# EAGLE design lcd (EAGLE 7.7.0)
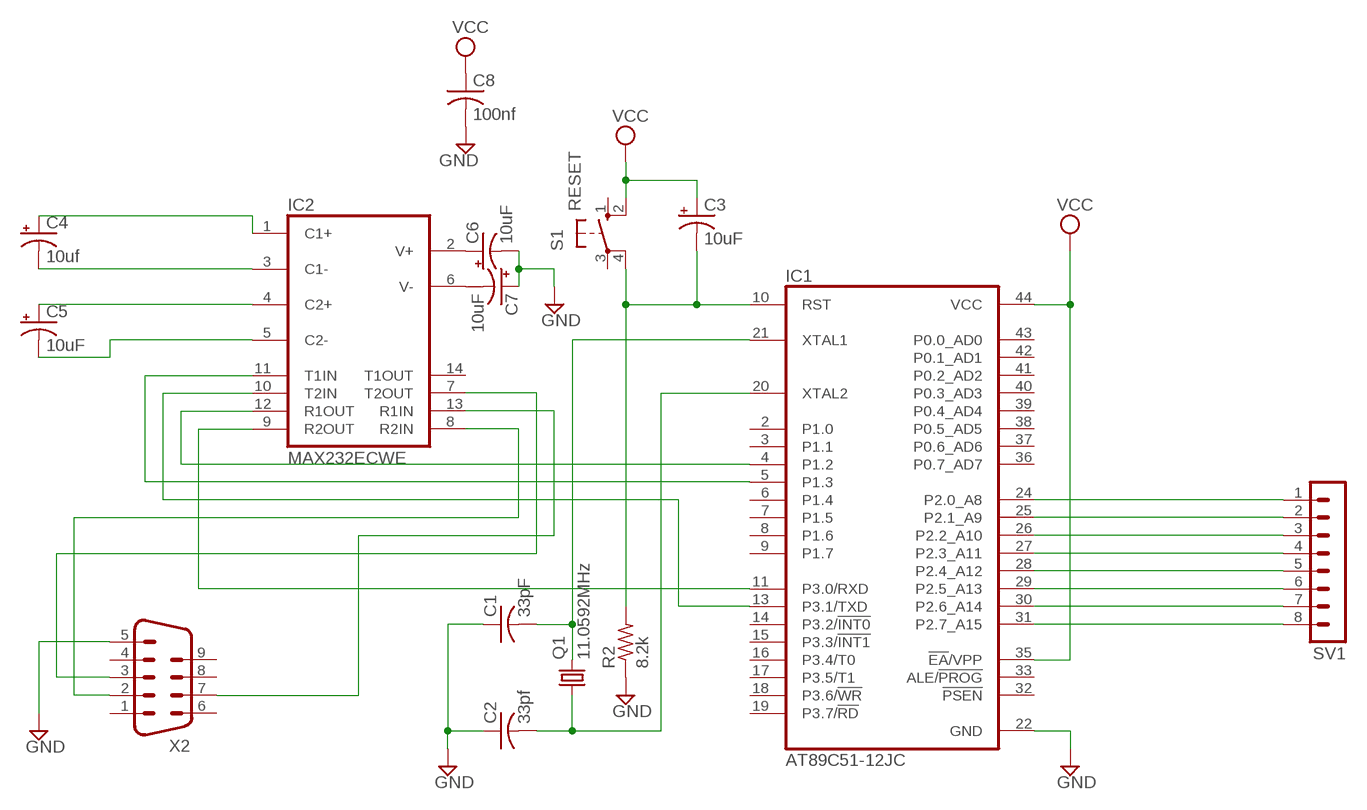
[diagram p0: schematic, sheet 1]

## Parts
C1  33pF  C-US025-025X050  [C025-025X050]
C2  33pf  C-US025-025X050  [C025-025X050]
C3  10uF  CPOL-USE2.5-5  [E2,5-5]
C4  10uf  CPOL-USE2.5-5  [E2,5-5]
C5  10uF  CPOL-USE2.5-5  [E2,5-5]
C6  10uF  CPOL-USE2.5-5  [E2,5-5]
C7  10uF  CPOL-USE2.5-5  [E2,5-5]
C8  100nf  C-US025-025X050  [C025-025X050]
IC1  AT89C51-12JC  [PLCC44]
IC2  MAX232ECWE  [SO16L]
Q1  11.0592MHz  CRYSTALTC26H  [TC26H]
R2  8.2k  R-US_R2512  [R2512]
S1  RESET  10-XX  [B3F-10XX]
SV1  MA08-1W  [MA08-1W]
X2  M09V  [M09V]

## Nets
GND: C1.1 C2.1 C6.- C7.+ C8.2 IC1.22(GND) R2.1 X2.5
N$1: IC1.24(P2.0_A8) SV1.1
N$2: IC1.25(P2.1_A9) SV1.2
N$3: IC1.26(P2.2_A10) SV1.3
N$4: IC1.27(P2.3_A11) SV1.4
N$5: IC1.28(P2.4_A12) SV1.5
N$6: IC1.29(P2.5_A13) SV1.6
N$7: IC1.30(P2.6_A14) SV1.7
N$8: IC1.31(P2.7_A15) SV1.8
N$9: IC1.5(P1.3) IC2.11(T1IN)
N$10: IC1.13(P3.1/TXD) IC2.10(T2IN)
N$11: IC1.4(P1.2) IC2.12(R1OUT)
N$12: C1.2 IC1.21(XTAL1) Q1.2
N$13: C2.2 IC1.20(XTAL2) Q1.1
N$14: IC1.11(P3.0/RXD) IC2.9(R2OUT)
N$15: C4.+ IC2.1(C1+)
N$16: C4.- IC2.3(C1-)
N$17: C3.- IC1.10(RST) R2.2 S1.4(P1)
N$18: C5.+ IC2.4(C2+)
N$19: C5.- IC2.5(C2-)
N$20: C6.+ IC2.2(V+)
N$21: C7.- IC2.6(V-)
N$22: IC2.7(T2OUT) X2.3
N$23: IC2.13(R1IN) X2.7
N$24: IC2.8(R2IN) X2.2
VCC: C3.+ C8.1 IC1.35(!EA!/VPP) IC1.44(VCC) S1.2(S1)
Unconnected: IC1.2(P1.0) IC1.3(P1.1) IC1.6(P1.4) IC1.7(P1.5) IC1.8(P1.6) IC1.9(P1.7) IC1.14(P3.2/!INT0) IC1.15(P3.3/!INT1) IC1.16(P3.4/T0) IC1.17(P3.5/T1) IC1.18(P3.6/!WR) IC1.19(P3.7/!RD) IC1.32(!PSEN) IC1.33(ALE/!PROG) IC1.36(P0.7_AD7) IC1.37(P0.6_AD6) IC1.38(P0.5_AD5) IC1.39(P0.4_AD4) IC1.40(P0.3_AD3) IC1.41(P0.2_AD2) IC1.42(P0.1_AD1) IC1.43(P0.0_AD0) IC2.14(T1OUT) S1.1(S) S1.3(P) X2.1 X2.4 X2.6 X2.8 X2.9

## Power pins joined to a net without a drawn wire
GND: IC2.15(GND)
VCC: IC2.16(VCC)

## Library data of the parts
C1 C2 C8 = rcl:C-US: CAPACITOR, American symbol
C3-C7 = rcl:CPOL-US: POLARIZED CAPACITOR, American symbol
IC1 = atmel:AT89C51-*: 8-bit Microcontroller with 4K Bytes Flash Not Recommended for New Designs. Use AT89S51. Source: http://www.atmel.com/dyn/resources/prod_documents/doc0265.; MPN: AT89C51ED2-SLSUM; OC_FARNELL: 1095722; OC_NEWARK: 78K5790
IC2 = maxim:MAX232ECWE: RS232 TRANSCEIVER; MF: MAXIM; MPN: MAX232ECWE+; OC_FARNELL: 9724435; OC_NEWARK: 67K4440
Q1 = crystal:CRYSTAL: CRYSTAL; OC_FARNELL: unknown; OC_NEWARK: unknown
R2 = rcl:R-US_: RESISTOR, American symbol
S1 = switch-omron:10-XX: OMRON SWITCH; MPN: B3F-1000; OC_FARNELL: 176432; OC_NEWARK: 36M3542
SV1 = con-lstb:MA08-1W: PIN HEADER; OC_FARNELL: unknown; OC_NEWARK: unknown
X2 = con-subd:M09: SUB-D; OC_FARNELL: unknown; OC_NEWARK: unknown

## Board
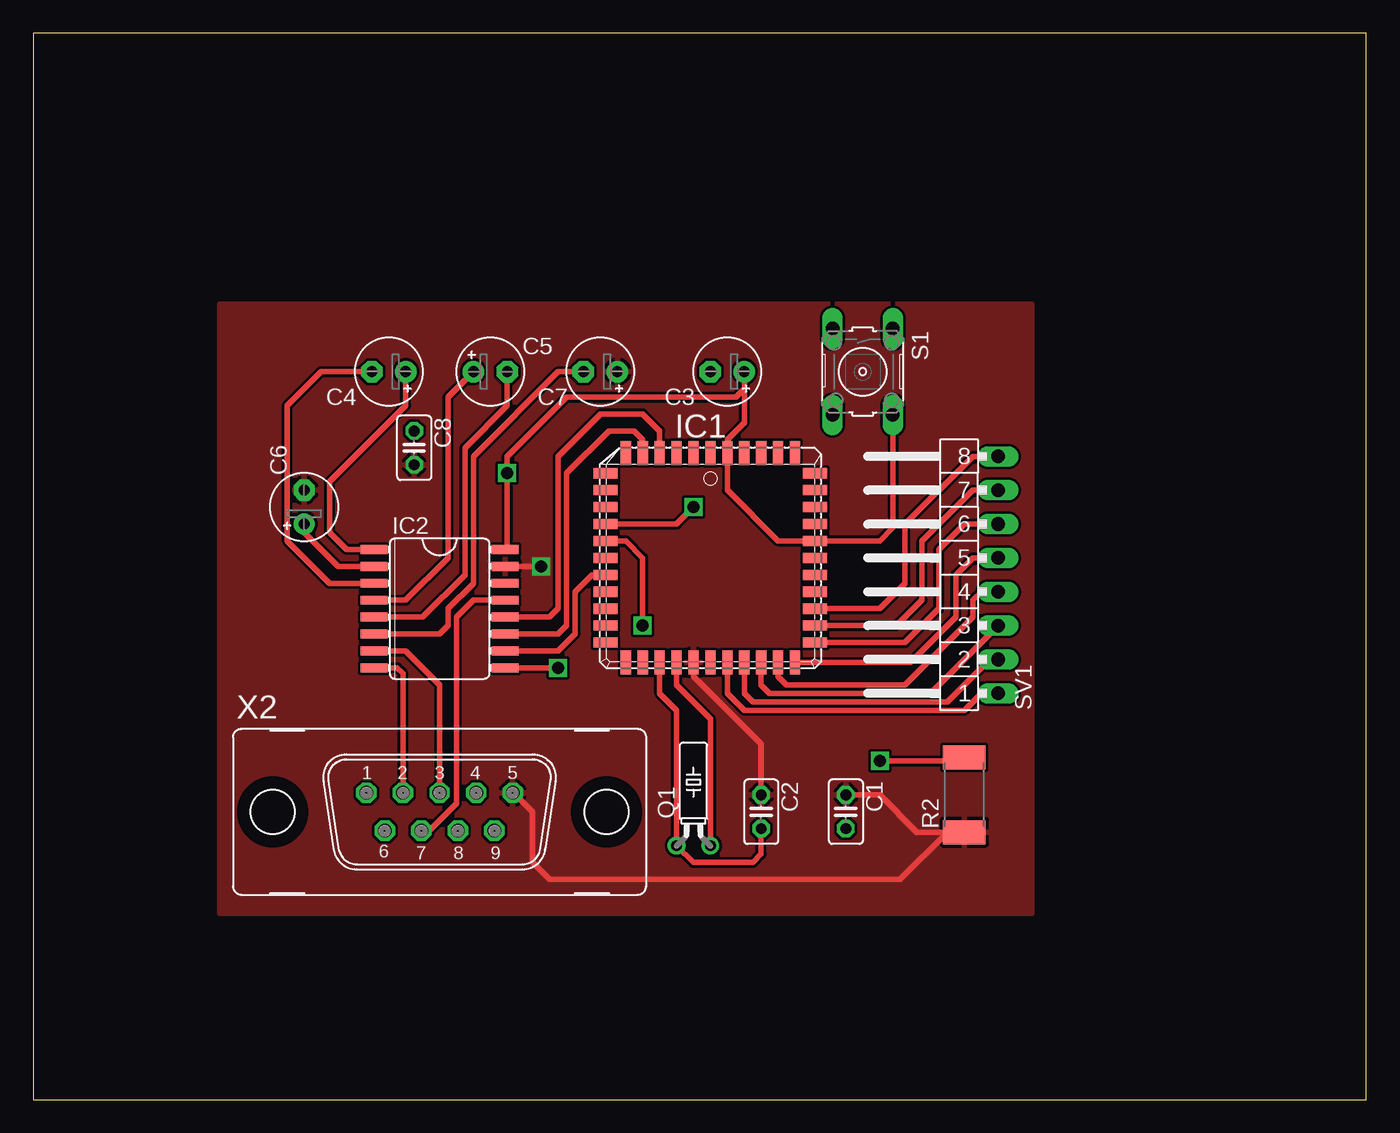
[diagram p1: board, top side]
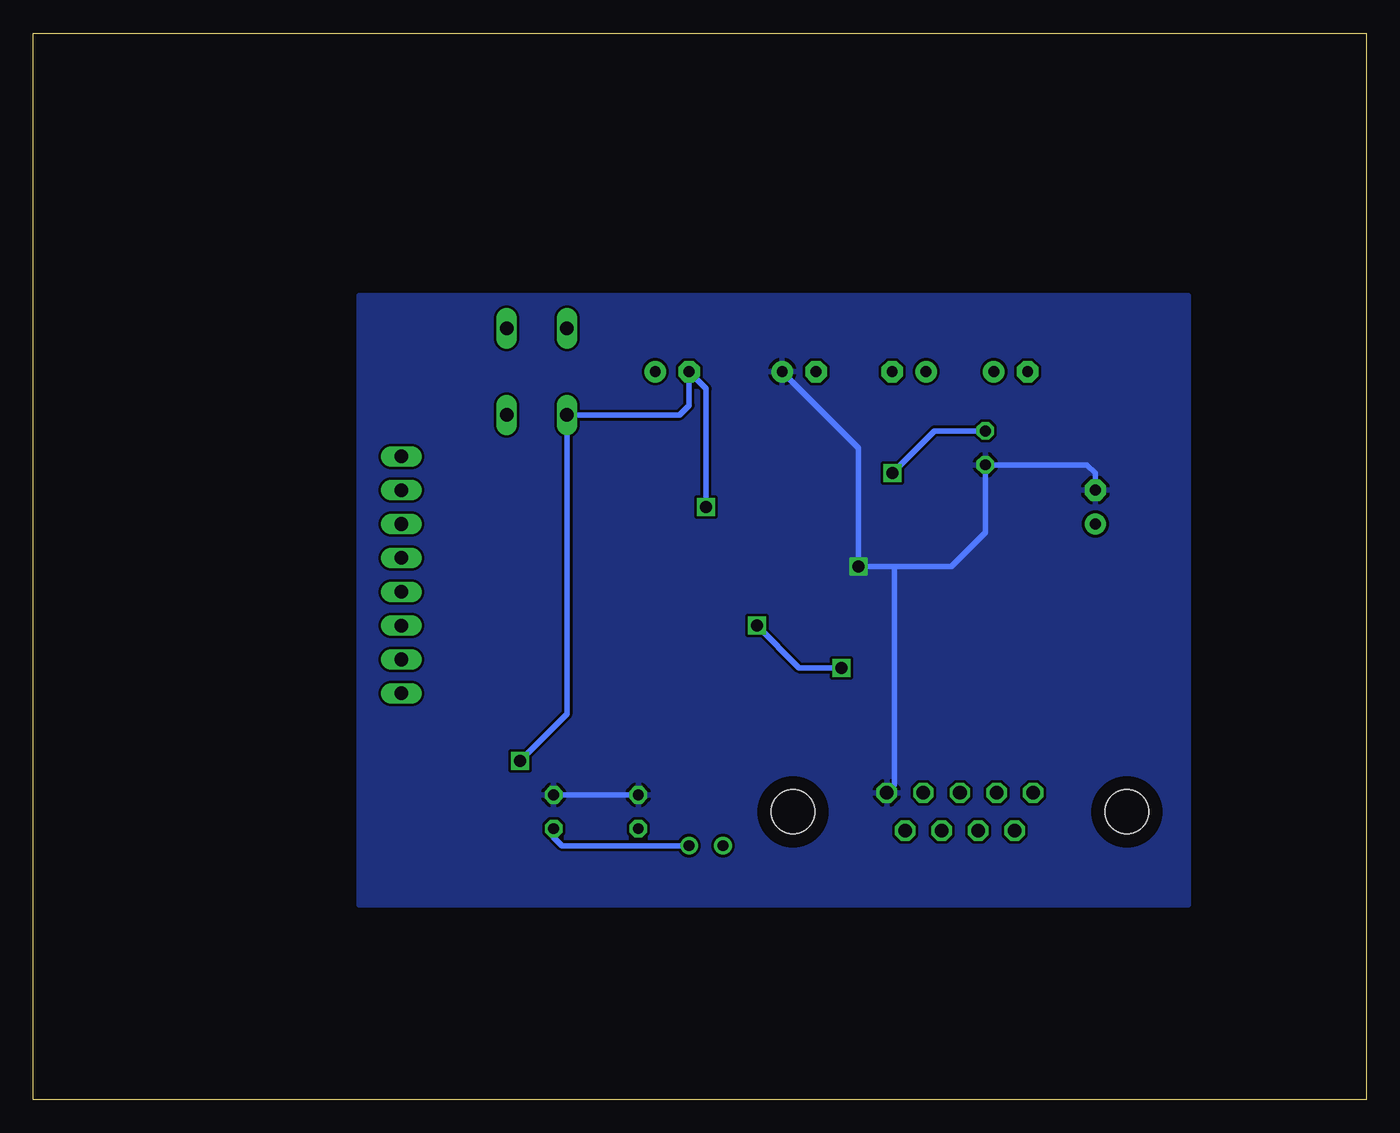
[diagram p2: board, bottom side, seen from below]

Size 100 x 80 mm. Coordinates in mm from the lower left corner, seen from the top.
Outline: 0,0 100,0 100,80 0,80 0,0
Copper layers (1*16): Top 0.035mm / dielectric 1.5mm / Bottom 0.035mm
Design rules "default": minimum track width 10mil, minimum drill 24mil, track to track 8mil, track to pad 8mil, pad to pad 8mil, via to via 8mil, smd to smd 8mil, copper to edge 40mil, drill to drill 8mil, minimum pad ring 10mil, minimum via ring 8mil, stop-mask expansion 4mil, vias tented up to drill 0mil, thermal gap 10mil

### Footprints (pad centres in the part's own frame; a part is rotated, then mirrored left to right if it is on the bottom)
C025-025X050 = drill 0.813 octagon: 1 -1.27,0; 2 1.27,0
E2,5-5 = drill 0.813 pad 1.6: + -1.27,0 | drill 0.813 pad 1.6 octagon: - 1.27,0
PLCC44 = smd 1.8 x 0.76: 1 -7.86,0; 2 -7.86,-1.27; 3 -7.86,-2.54; 4 -7.86,-3.81; 5 -7.86,-5.08; 6 -7.86,-6.35; 18 7.86,-6.35; 19 7.86,-5.08; 20 7.86,-3.81; 21 7.86,-2.54; 22 7.86,-1.27; 23 7.86,0; 24 7.86,1.27; 25 7.86,2.54; 26 7.86,3.81; 27 7.86,5.08; 28 7.86,6.35; 40 -7.86,6.35; 41 -7.86,5.08; 42 -7.86,3.81; 43 -7.86,2.54; 44 -7.86,1.27 | smd 0.76 x 1.8: 7 -6.35,-7.86; 8 -5.08,-7.86; 9 -3.81,-7.86; 10 -2.54,-7.86; 11 -1.27,-7.86; 12 0,-7.86; 13 1.27,-7.86; 14 2.54,-7.86; 15 3.81,-7.86; 16 5.08,-7.86; 17 6.35,-7.86; 29 6.35,7.86; 30 5.08,7.86; 31 3.81,7.86; 32 2.54,7.86; 33 1.27,7.86; 34 0,7.86; 35 -1.27,7.86; 36 -2.54,7.86; 37 -3.81,7.86; 38 -5.08,7.86; 39 -6.35,7.86
SO16L = smd 0.66 x 2.032: 1 -4.445,-4.902; 2 -3.175,-4.902; 3 -1.905,-4.902; 4 -0.635,-4.902; 5 0.635,-4.902; 6 1.905,-4.902; 7 3.175,-4.902; 8 4.445,-4.902; 9 4.445,4.902; 10 3.175,4.902; 11 1.905,4.902; 12 0.635,4.902; 13 -0.635,4.902; 14 -1.905,4.902; 15 -3.175,4.902; 16 -4.445,4.902
TC26H = drill 0.813: 1 -1.27,0; 2 1.27,0
R2512 = smd 1.8 x 3.2: 1 -2.8,0; 2 2.8,0
B3F-10XX = drill 1.016 long: 1 -3.251,2.261; 2 3.251,2.261; 3 -3.251,-2.261; 4 3.251,-2.261
MA08-1W = drill 1.016 long: 1 -8.89,0; 2 -6.35,0; 3 -3.81,0; 4 -1.27,0; 5 1.27,0; 6 3.81,0; 7 6.35,0; 8 8.89,0
M09V = drill 1.016 octagon: 1 -5.486,1.422; 2 -2.743,1.422; 3 0,1.422; 4 2.743,1.422; 5 5.486,1.422; 6 -4.115,-1.422; 7 -1.372,-1.422; 8 1.372,-1.422; 9 4.115,-1.422 | hole 3.302: -12.522,0; 12.522,0

### Placement (x,y rotation side)
C1  60.96,21.59 270 top
C2  54.61,21.59 270 top
C3  52.07,54.61 180 top
C4  26.67,54.61 180 top
C5  34.29,54.61 0 top
C6  20.32,44.45 90 top
C7  42.55,54.61 180 top
C8  28.57,48.9 270 top
IC1  50.8,40.64 270 top
IC2  30.48,36.83 270 top
Q1  49.53,19.05 0 top
R2  69.85,22.86 90 top
S1  62.23,54.61 270 top
SV1  72.39,39.37 90 top
X2  30.48,21.59 0 top

### Tracks (layer width: path | path; a pad name or v marks a point on that pad's centre or on a via)
GND  (via drill 0.9)
  Top 0.406: R2.1 68.58,20.06 | 68.58,20.06 66.3,20.06 63.5,22.86 C1.1 | IC1.22 49.53,31.75 54.61,26.67 C2.1 | X2.5 36.04,23.01 37.47,21.59 37.47,17.78 38.73,16.51 65.03,16.51 68.58,20.06 | v38.1,40.01 IC2.15
  Bottom 0.406: C2.1 C1.1 | v38.1,40.01 IC2.15 35.38,23.6 X2.5 | v38.1,40.01 38.1,48.9 C7.+ | v38.1,40.01 31.11,40.01 28.57,42.55 C8.2 20.95,47.62 20.32,46.99 C6.-
  pour Top: 15.24,59.69 74.93,59.69 74.93,13.97 13.97,13.97 13.97,59.69
  pour Bottom: 13.34,60.33 75.56,60.33 75.56,14.61 13.34,14.61
N$1
  Top 0.406: SV1.1 71.12,30.48 69.85,29.21 53.34,29.21 52.07,30.48 IC1.24
N$2
  Top 0.406: SV1.2 71.75,33.02 68.58,29.84 53.98,29.84 53.34,30.48 IC1.25
N$3
  Top 0.406: SV1.3 67.31,30.48 55.24,30.48 54.61,31.11 IC1.26
N$4
  Top 0.406: IC1.27 55.88,31.75 56.52,31.11 65.41,31.11 70.48,36.2 70.48,37.47 71.12,38.1 SV1.4
N$5
  Top 0.406: IC1.28 65.8,32.78 69.22,36.2 69.22,39.37 70.48,40.64 SV1.5
N$6
  Top 0.406: IC1.29 65.41,34.29 67.94,36.83 67.94,41.27 69.85,43.18 SV1.6
N$7
  Top 0.406: IC1.30 64.77,35.56 66.67,37.47 66.67,41.91 70.48,45.72 SV1.7
N$8
  Top 0.406: IC1.31 63.5,36.83 65.41,38.73 65.41,43.18 70.48,48.26 SV1.8
N$9
  Top 0.406: IC1.5 45.72,49.53 45.09,50.16 43.18,50.16 40.01,46.99 40.01,35.56 39.37,34.92 IC2.11
N$10
  Top 0.406: IC1.13 41.91,39.37 40.64,38.1 40.64,34.92 39.37,33.66 IC2.10
N$11
  Top 0.406: IC1.4 46.99,50.16 45.72,51.44 42.55,51.44 39.37,48.26 39.37,36.83 38.73,36.2 IC2.12
N$12
  Top 0.406: IC1.21 48.26,31.11 50.8,28.57 Q1.2
  Bottom 0.406: Q1.2 60.33,19.05 60.96,19.68 C1.2
N$13
  Top 0.406: IC1.20 46.99,30.48 48.26,29.21 Q1.1 49.53,17.78 53.98,17.78 54.61,18.41 C2.2
N$14  (via drill 0.9)
  Top 0.406: IC1.11 44.45,41.91 45.72,40.64 v45.72,35.56 | v39.37,32.38 IC2.9
  Bottom 0.406: v45.72,35.56 42.55,32.38 v39.37,32.38
N$15
  Top 0.406: IC2.1 23.5,41.27 22.23,42.55 22.23,46.35 27.94,52.07 C4.+
N$16
  Top 0.406: IC2.3 22.23,38.73 19.05,41.91 19.05,52.07 21.59,54.61 C4.-
N$17  (via drill 0.9)
  Top 0.406: IC1.10 48.26,43.18 v49.53,44.45 | v63.5,25.4 69.59,25.4 R2.2
  Bottom 0.406: v49.53,44.45 49.53,53.34 C3.- 50.8,52.07 51.51,51.36 S1.4 59.97,28.93 v63.5,25.4
N$18
  Top 0.406: IC2.4 27.94,37.47 31.11,40.64 31.11,52.7 C5.+
N$19
  Top 0.406: IC2.5 29.21,36.2 32.38,39.37 32.38,48.9 35.56,52.07 C5.-
N$20
  Top 0.406: C6.+ 20.32,42.55 22.86,40.01 IC2.2
N$21
  Top 0.406: IC2.6 30.48,34.92 31.11,35.56 31.11,36.83 33.02,38.73 33.02,48.26 39.37,54.61 C7.-
N$22
  Top 0.406: IC2.7 27.94,33.66 30.48,31.11 X2.3
N$23
  Top 0.406: X2.7 29.69,20.17 31.75,22.23 31.75,36.2 33.02,37.47 IC2.13
N$24
  Top 0.406: X2.2 27.74,31.95 27.3,32.38 IC2.8
VCC  (via drill 0.9)
  Top 0.406: S1.2 64.49,42.9 63.5,41.91 IC1.35 55.88,41.91 52.07,45.72 IC1.44 52.07,49.53 53.34,50.8 53.34,53.34 | 53.34,53.34 C3.+ | IC2.16 35.56,41.45 v35.56,46.99 35.56,48.26 40.01,52.7 52.7,52.7 53.34,53.34
  Bottom 0.406: C8.1 32.38,50.16 v35.56,46.99